# Altium schematic sheet WS2812_MATRIX_3.SchDoc
size A4
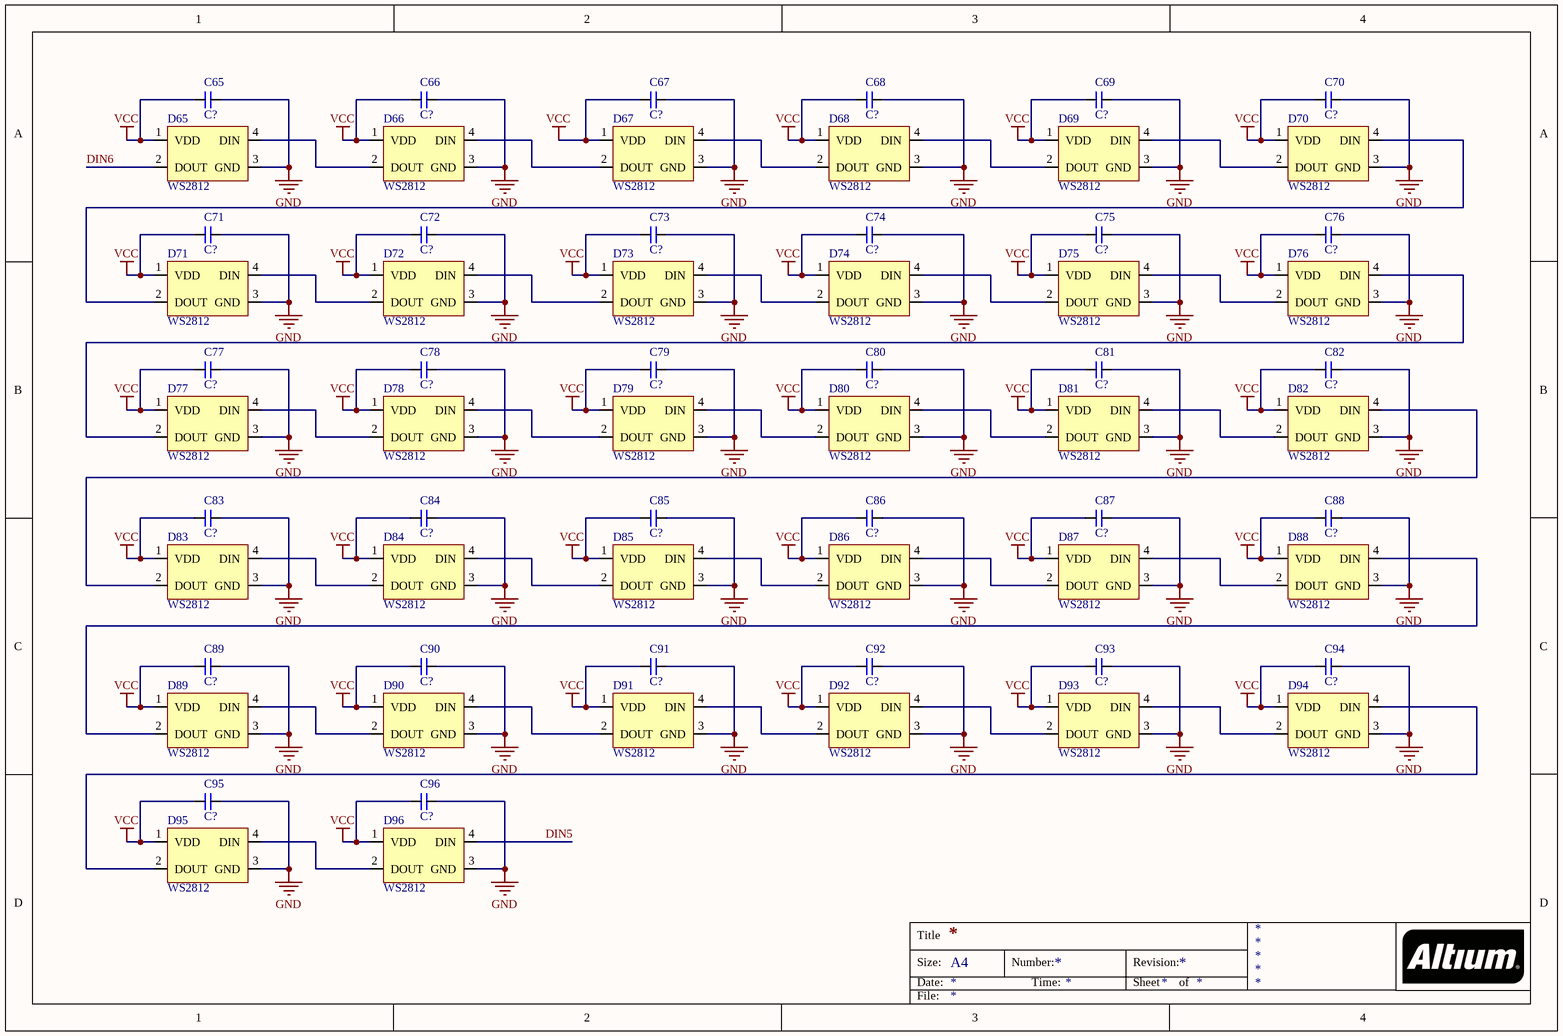
[diagram p0: WS2812_MATRIX_3.SchDoc]

## Parts
C65  C?  [C0603]
C66  C?  [C0603]
C67  C?  [C0603]
C68  C?  [C0603]
C69  C?  [C0603]
C70  C?  [C0603]
C71  C?  [C0603]
C72  C?  [C0603]
C73  C?  [C0603]
C74  C?  [C0603]
C75  C?  [C0603]
C76  C?  [C0603]
C77  C?  [C0603]
C78  C?  [C0603]
C79  C?  [C0603]
C80  C?  [C0603]
C81  C?  [C0603]
C82  C?  [C0603]
C83  C?  [C0603]
C84  C?  [C0603]
C85  C?  [C0603]
C86  C?  [C0603]
C87  C?  [C0603]
C88  C?  [C0603]
C89  C?  [C0603]
C90  C?  [C0603]
C91  C?  [C0603]
C92  C?  [C0603]
C93  C?  [C0603]
C94  C?  [C0603]
C95  C?  [C0603]
C96  C?  [C0603]
D65  WS2812  [WS2812_3528]
D66  WS2812  [WS2812_3528]
D67  WS2812  [WS2812_3528]
D68  WS2812  [WS2812_3528]
D69  WS2812  [WS2812_3528]
D70  WS2812  [WS2812_3528]
D71  WS2812  [WS2812_3528]
D72  WS2812  [WS2812_3528]
D73  WS2812  [WS2812_3528]
D74  WS2812  [WS2812_3528]
D75  WS2812  [WS2812_3528]
D76  WS2812  [WS2812_3528]
D77  WS2812  [WS2812_3528]
D78  WS2812  [WS2812_3528]
D79  WS2812  [WS2812_3528]
D80  WS2812  [WS2812_3528]
D81  WS2812  [WS2812_3528]
D82  WS2812  [WS2812_3528]
D83  WS2812  [WS2812_3528]
D84  WS2812  [WS2812_3528]
D85  WS2812  [WS2812_3528]
D86  WS2812  [WS2812_3528]
D87  WS2812  [WS2812_3528]
D88  WS2812  [WS2812_3528]
D89  WS2812  [WS2812_3528]
D90  WS2812  [WS2812_3528]
D91  WS2812  [WS2812_3528]
D92  WS2812  [WS2812_3528]
D93  WS2812  [WS2812_3528]
D94  WS2812  [WS2812_3528]
D95  WS2812  [WS2812_3528]
D96  WS2812  [WS2812_3528]

## Nets
GND: C65.2 C66.2 C67.2 C68.2 C69.2 C70.2 C71.2 C72.2 C73.2 C74.2 C75.2 C76.2 C77.2 C78.2 C79.2 C80.2 C81.2 C82.2 C83.2 C84.2 C85.2 C86.2 C87.2 C88.2 C89.2 C90.2 C91.2 C92.2 C93.2 C94.2 C95.2 C96.2 D65.3(GND) D66.3(GND) D67.3(GND) D68.3(GND) D69.3(GND) D70.3(GND) D71.3(GND) D72.3(GND) D73.3(GND) D74.3(GND) D75.3(GND) D76.3(GND) D77.3(GND) D78.3(GND) D79.3(GND) D80.3(GND) D81.3(GND) D82.3(GND) D83.3(GND) D84.3(GND) D85.3(GND) D86.3(GND) D87.3(GND) D88.3(GND) D89.3(GND) D90.3(GND) D91.3(GND) D92.3(GND) D93.3(GND) D94.3(GND) D95.3(GND) D96.3(GND)
VCC: C65.1 C66.1 C67.1 C68.1 C69.1 C70.1 C71.1 C72.1 C73.1 C74.1 C75.1 C76.1 C77.1 C78.1 C79.1 C80.1 C81.1 C82.1 C83.1 C84.1 C85.1 C86.1 C87.1 C88.1 C89.1 C90.1 C91.1 C92.1 C93.1 C94.1 C95.1 C96.1 D65.1(VDD) D66.1(VDD) D67.1(VDD) D68.1(VDD) D69.1(VDD) D70.1(VDD) D71.1(VDD) D72.1(VDD) D73.1(VDD) D74.1(VDD) D75.1(VDD) D76.1(VDD) D77.1(VDD) D78.1(VDD) D79.1(VDD) D80.1(VDD) D81.1(VDD) D82.1(VDD) D83.1(VDD) D84.1(VDD) D85.1(VDD) D86.1(VDD) D87.1(VDD) D88.1(VDD) D89.1(VDD) D90.1(VDD) D91.1(VDD) D92.1(VDD) D93.1(VDD) D94.1(VDD) D95.1(VDD) D96.1(VDD)
DIN5: D96.4(DIN)
DIN6: D65.2(DOUT)
NetD65_4: D65.4(DIN) D66.2(DOUT)
NetD66_4: D66.4(DIN) D67.2(DOUT)
NetD67_4: D67.4(DIN) D68.2(DOUT)
NetD68_4: D68.4(DIN) D69.2(DOUT)
NetD69_4: D69.4(DIN) D70.2(DOUT)
NetD70_4: D70.4(DIN) D71.2(DOUT)
NetD71_4: D71.4(DIN) D72.2(DOUT)
NetD72_4: D72.4(DIN) D73.2(DOUT)
NetD73_4: D73.4(DIN) D74.2(DOUT)
NetD74_4: D74.4(DIN) D75.2(DOUT)
NetD75_4: D75.4(DIN) D76.2(DOUT)
NetD76_4: D76.4(DIN) D77.2(DOUT)
NetD77_4: D77.4(DIN) D78.2(DOUT)
NetD78_4: D78.4(DIN) D79.2(DOUT)
NetD79_4: D79.4(DIN) D80.2(DOUT)
NetD80_4: D80.4(DIN) D81.2(DOUT)
NetD81_4: D81.4(DIN) D82.2(DOUT)
NetD82_4: D82.4(DIN) D83.2(DOUT)
NetD83_4: D83.4(DIN) D84.2(DOUT)
NetD84_4: D84.4(DIN) D85.2(DOUT)
NetD85_4: D85.4(DIN) D86.2(DOUT)
NetD86_4: D86.4(DIN) D87.2(DOUT)
NetD87_4: D87.4(DIN) D88.2(DOUT)
NetD88_4: D88.4(DIN) D89.2(DOUT)
NetD89_4: D89.4(DIN) D90.2(DOUT)
NetD90_4: D90.4(DIN) D91.2(DOUT)
NetD91_4: D91.4(DIN) D92.2(DOUT)
NetD92_4: D92.4(DIN) D93.2(DOUT)
NetD93_4: D93.4(DIN) D94.2(DOUT)
NetD94_4: D94.4(DIN) D95.2(DOUT)
NetD95_4: D95.4(DIN) D96.2(DOUT)

## Notes on the sheet
- Title
- Size:
- Date:
- A4
- Number:
- Time:
- Revision:
- Sheet
- of
- File:

## Library data of the parts
C65-C96 = CAP